# Altium schematic sheet Temperature_Measurement.SchDoc: Vacuum chamber sensorboard - Thermocouple interface
size A4; SheetNumber: 2; SheetTotal: 6
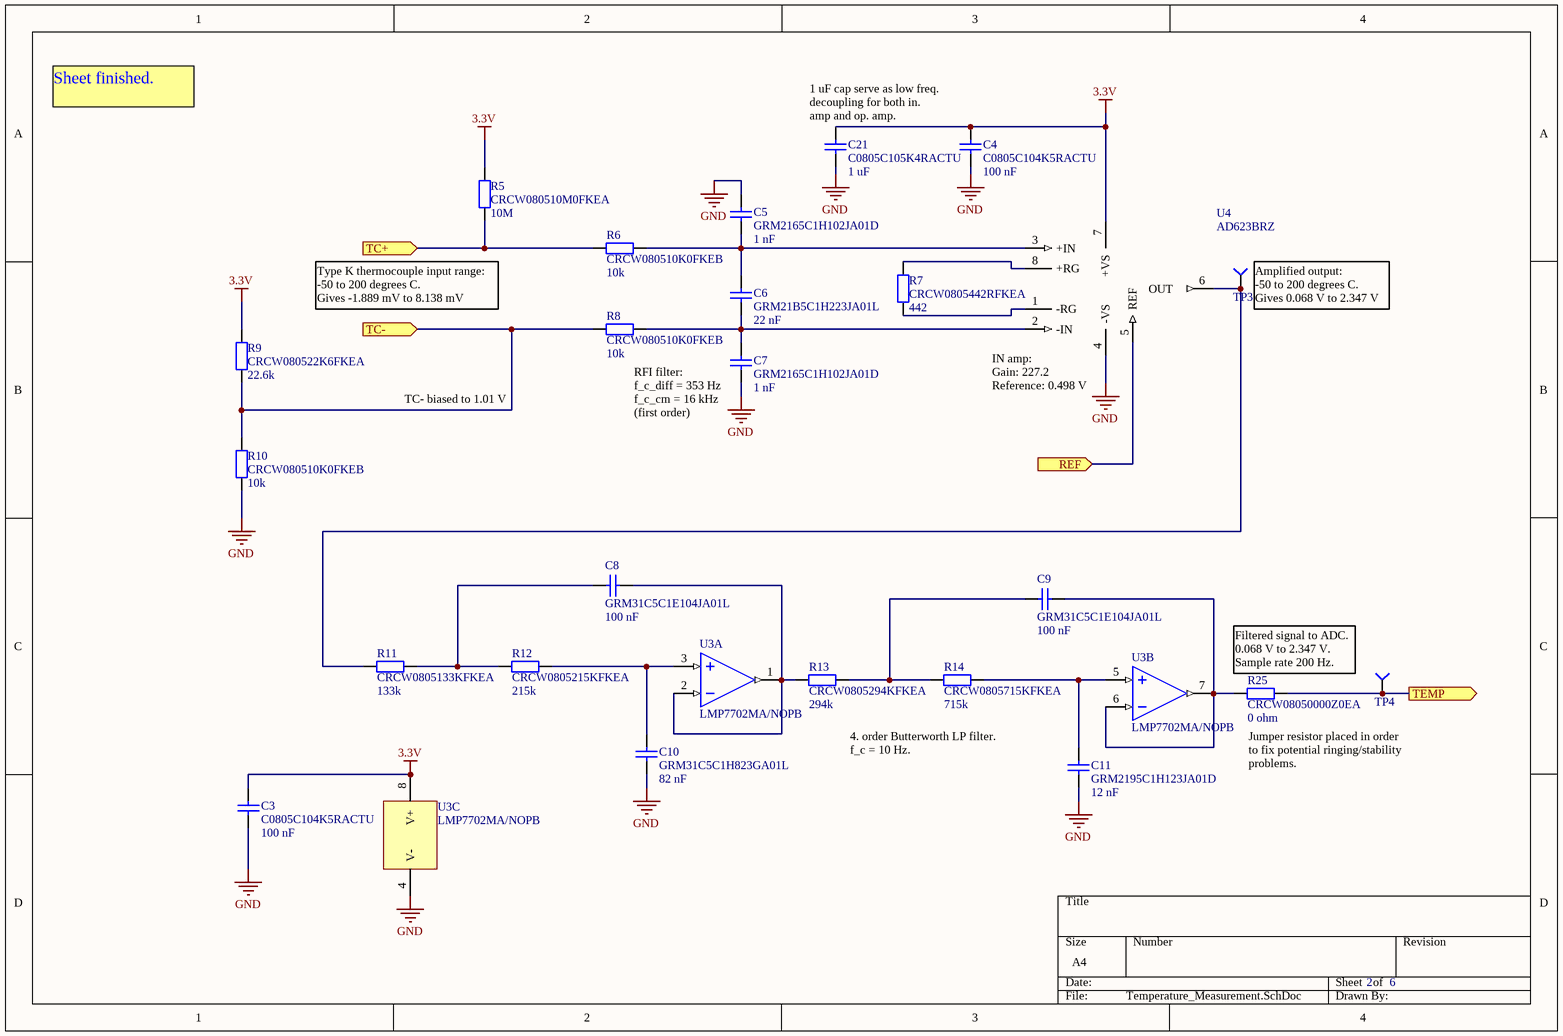
[diagram p0: Temperature_Measurement.SchDoc]

## Parts
C3  C0805C104K5RACTU  value 100 nF  [Cap Kemet 0805]
C4  C0805C104K5RACTU  value 100 nF  [Cap Kemet 0805]
C5  GRM2165C1H102JA01D  value 1 nF  [CAP0805 murata]
C6  GRM21B5C1H223JA01L  value 22 nF  [CAP0805 murata]
C7  GRM2165C1H102JA01D  value 1 nF  [CAP0805 murata]
C8  GRM31C5C1E104JA01L  value 100 nF  [Cap1206 Murata]
C9  GRM31C5C1E104JA01L  value 100 nF  [Cap1206 Murata]
C10  GRM31C5C1H823GA01L  value 82 nF  [Cap1206 Murata]
C11  GRM2195C1H123JA01D  value 12 nF  [CAP0805 murata]
C21  C0805C105K4RACTU  value 1 uF  [Cap Kemet 0805]
R5  CRCW080510M0FKEA  value 10M  [Res Vishay0805]
R6  CRCW080510K0FKEB  value 10k  [Res Vishay0805]
R7  CRCW0805442RFKEA  value 442  [Res Vishay0805]
R8  CRCW080510K0FKEB  value 10k  [Res Vishay0805]
R9  CRCW080522K6FKEA  value 22.6k  [Res Vishay0805]
R10  CRCW080510K0FKEB  value 10k  [Res Vishay0805]
R11  CRCW0805133KFKEA  value 133k  [Res Vishay0805]
R12  CRCW0805215KFKEA  value 215k  [Res Vishay0805]
R13  CRCW0805294KFKEA  value 294k  [Res Vishay0805]
R14  CRCW0805715KFKEA  value 715k  [Res Vishay0805]
R25  CRCW08050000Z0EA  value 0 ohm  [Res Vishay0805]
TP3  Test_point  [Testpoint]  (value not drawn)
TP4  Test_point  [Testpoint]  (value not drawn)
U3  LMP7702MA/NOPB  [OPA2333AIDR]  (parts A,B,C of 3)
U4  AD623BRZ  [AD623]

## Ports
REF (in), TC+ (in), TC- (in), TEMP (out)

## Nets
3.3V: C3.2 C4.2 C21.2 R5.2 R9.2 U3.8(V+) U4.7(+VS)
GND: C3.1 C4.1 C5.2 C7.1 C10.1 C11.1 C21.1 R10.1 U3.4(V-) U4.4(-VS)
REF: U4.5(REF) ; port REF
TC+: R5.1 R6.1 ; port TC+
TC-: R8.1 R9.1 R10.2 ; port TC-
TEMP: R25.2 TP4.0 ; port TEMP
NetC5_1: C5.1 C6.2 R6.2 U4.3(+IN)
NetC6_1: C6.1 C7.2 R8.2 U4.2(-IN)
NetC8_1: C8.1 R13.1 U3.1(OUT_A) U3.2(-IN_A)
NetC8_2: C8.2 R11.2 R12.1
NetC9_1: C9.1 R25.1 U3.6(-IN_B) U3.7(OUT_B)
NetC9_2: C9.2 R13.2 R14.1
NetC10_2: C10.2 R12.2 U3.3(+IN_A)
NetC11_2: C11.2 R14.2 U3.5(+IN_B)
NetR7_1: R7.1 U4.1(-RG)
NetR7_2: R7.2 U4.8(+RG)
NetR11_1: R11.1 TP3.0 U4.6(OUT)

## Notes on the sheet
- Sheet finished.
- (near C21) 1 uF cap serve as low freq. decoupling for both in. amp and op. amp.
- Type K thermocouple input range:
  -50 to 200 degrees C.
  Gives -1.889 mV to 8.138 mV
- (near TP3) Amplified output:
  -50 to 200 degrees C.
  Gives 0.068 V to 2.347 V
- TC- biased to 1.01 V
- (near C7) RFI filter:
  f_c_diff = 353 Hz
  f_c_cm = 16 kHz
  (first order)
- (near U4) IN amp:
  Gain: 227.2
  Reference: 0.498 V
- Filtered signal to ADC.
  0.068 V to 2.347 V.
  Sample rate 200 Hz.
- 4. order Butterworth LP filter.
  f_c = 10 Hz.
- Jumper resistor placed in order to fix potential ringing/stability problems.

## Library data of the parts
C3 C4 = C0805C104K5RACTU: Ceramic capacitor, X7R, 10%, 50V; Manufacturer: Kemet; ComponentLink1Description: Datasheet; ComponentLink1URL: http://www.kemet.com/kemet/web/homepage/kechome.nsf/vapubfiles/KEM_C1002_X7R_SMD.pdf/$file/KEM_C1002_X7R_SMD.pdf; PackageReference: 0805; Supplier 1: Mouser; Supplier Part Number 1: 80-C0805C104K5R; Supplier 2: Farnell; Supplier Part Number 2: 1414664
C5 C7 = GRM2165C1H102JA01D: Ceramic capacitor, C0G, 5%, 50V; Manufacturer: Murata; ComponentLink1Description: Datasheet; ComponentLink1URL: http://psearch.murata.com/capacitor/product/GRM2165C1H102JA01%23.pdf; PackageReference: 0805; Supplier 1: Mouser; Supplier Part Number 1: 81-GRM40C102J50D
C6 = GRM21B5C1H223JA01L: Ceramic capacitor, C0G, 5%, 50V; Manufacturer: Murata; ComponentLink1Description: Datasheet; ComponentLink1URL: http://psearch.murata.com/capacitor/product/GRM21B5C1H223JA01%23.pdf; PackageReference: 0805; Supplier 1: Mouser; Supplier Part Number 1: 81-GRM215C1H223JA01L; Supplier 2: Farnell; Supplier Part Number 2: 1828943
C8 C9 = GRM31C5C1E104JA01L: Ceramic capacitor, C0G, 5%, 25V; Manufacturer: Murata; ComponentLink1Description: Datasheet; ComponentLink1URL: http://psearch.murata.com/capacitor/product/GRM31C5C1E104JA01%23.pdf; PackageReference: 1206; Supplier 1: Mouser; Supplier Part Number 1: 81-GRM31C5C1E104JA01
C10 = GRM31C5C1H823GA01L: Ceramic capacitor, C0G, 2%, 50V; Manufacturer: Murata; ComponentLink1Description: Datasheet; ComponentLink1URL: http://www.murata.com/products/catalog/pdf/c02e.pdf; PackageReference: 1206; Supplier 1: Mouser; Supplier Part Number 1: 81-GRM31C5C1H823GA1L
C11 = GRM2195C1H123JA01D: Ceramic capacitor, C0G, 5%, 50V; Manufacturer: Murata; ComponentLink1Description: Datasheet; ComponentLink1URL: http://psearch.murata.com/capacitor/product/GRM2195C1H123JA01%23.pdf; PackageReference: 0805; Supplier 1: Mouser; Supplier Part Number 1: 81-GRM2195C1H123JA1D
C21 = C0805C105K4RACTU: Ceramic capacitor, X7R, 10%, 16V; Manufacturer: Kemet; ComponentLink1Description: Datasheet; ComponentLink1URL: http://www.kemet.com/kemet/web/homepage/kechome.nsf/vapubfiles/KEM_C1002_X7R_SMD.pdf/$file/KEM_C1002_X7R_SMD.pdf; PackageReference: 0805; Supplier 1: Mouser; Supplier Part Number 1: 80-C0805C105K4R; Supplier 2: Farnell; Supplier Part Number 2: 9227792
R5 = CRCW080510M0FKEA: Thick film resistor, 1%, 125mW; Manufacturer: Vishay; ComponentLink1Description: Datasheet; ComponentLink1URL: http://www.vishay.com/docs/20035/dcrcwe3.pdf; PackageReference: 0805; Supplier 1: Mouser; Supplier Part Number 1: 71-CRCW0805-10M-E3
R6 R8 R10 = CRCW080510K0FKEB: Thick film resistor, 1%, 125mW; Manufacturer: Vishay; ComponentLink1Description: Datasheet; ComponentLink1URL: http://www.vishay.com/docs/20035/dcrcwe3.pdf; PackageReference: 0805; Supplier 1: Mouser; Supplier Part Number 1: 71-CRCW080510K0FKEB
R7 = CRCW0805442RFKEA: Thick film resistor, 1%, 125mW; Manufacturer: Vishay; ComponentLink1Description: Datasheet; ComponentLink1URL: http://www.vishay.com/docs/20035/dcrcwe3.pdf; PackageReference: 0805; Supplier 1: Mouser; Supplier Part Number 1: 71-CRCW0805-442-E3
R9 = CRCW080522K6FKEA: Thick film resistor, 1%, 125mW; Manufacturer: Vishay; ComponentLink1Description: Datasheet; ComponentLink1URL: http://www.vishay.com/docs/20035/dcrcwe3.pdf; PackageReference: 0805; Supplier 1: Mouser; Supplier Part Number 1: 71-CRCW0805-22.6K-E3; Supplier 2: Farnell; Supplier Part Number 2: 1652961
R11 = CRCW0805133KFKEA: Thick film resistor, 1%, 125mW; Manufacturer: Vishay; ComponentLink1Description: Datasheet; ComponentLink1URL: http://www.vishay.com/docs/20035/dcrcwe3.pdf; PackageReference: 0805; Supplier 1: Mouser; Supplier Part Number 1: 71-CRCW0805-133K-E3
R12 = CRCW0805215KFKEA: Thick film resistor, 1%, 125mW; Manufacturer: Vishay; ComponentLink1Description: Datasheet; ComponentLink1URL: http://www.vishay.com/docs/20035/dcrcwe3.pdf; PackageReference: 0805; Supplier 1: Mouser; Supplier Part Number 1: 71-CRCW0805-215K-E3; Supplier 2: Farnell; Supplier Part Number 2: 1652955
R13 = CRCW0805294KFKEA: Thick film resistor, 1%, 125mW; Manufacturer: Vishay; ComponentLink1Description: Datasheet; ComponentLink1URL: http://www.vishay.com/docs/20035/dcrcwe3.pdf; PackageReference: 0805; Supplier 1: Mouser; Supplier Part Number 1: 71-CRCW0805294KFKEA
R14 = CRCW0805715KFKEA: Thick film resistor, 1%, 125mW; Manufacturer: Vishay; ComponentLink1Description: Datasheet; ComponentLink1URL: http://www.vishay.com/docs/20035/dcrcwe3.pdf; PackageReference: 0805; Supplier 1: Mouser; Supplier Part Number 1: 71-CRCW0805715KFKEA
R25 = CRCW08050000Z0EA: Thick film resistor, 1%, 125mW; Manufacturer: Vishay; ComponentLink1Description: Datasheet; ComponentLink1URL: http://www.vishay.com/docs/20035/dcrcwe3.pdf; PackageReference: 0805; Supplier 1: Mouser; Supplier Part Number 1: 71-CRCW0805-0-E3
TP3 TP4 = Test_point: pin to pad: 0>1; ComponentLink1Description: Datasheet
U3 = LMP7702MA/NOPB: Op. amp, dual, rail-to-rail, single supply; PackageReference: SOIC-8; ComponentLink1Description: Datasheet; ComponentLink1URL: http://www.ti.com/lit/ds/symlink/lmp7702.pdf; Supplier 1: Farnell; Supplier Part Number 1: 1651867
U4 = AD623BRZ: Instrumentation amplifier, rail to rail; ComponentLink1Description: Datasheet; ComponentLink1URL: http://www.analog.com/static/imported-files/data_sheets/AD623.pdf; Supplier 1: Mouser; Supplier Part Number 1: 584-AD623BRZ; PackageReference: SOIC-8; Supplier 2: Farnell; Supplier Part Number 2: 2305589